# EasyEDA schematic RPi_Argon_WateringSystem.json
TITLE: Schematic RPi/Argon Watering System; REV: 1.0; Date: 2021-05-22; Sheet: 1/1; Drawn By: Tiffany Nolan; Company: Student
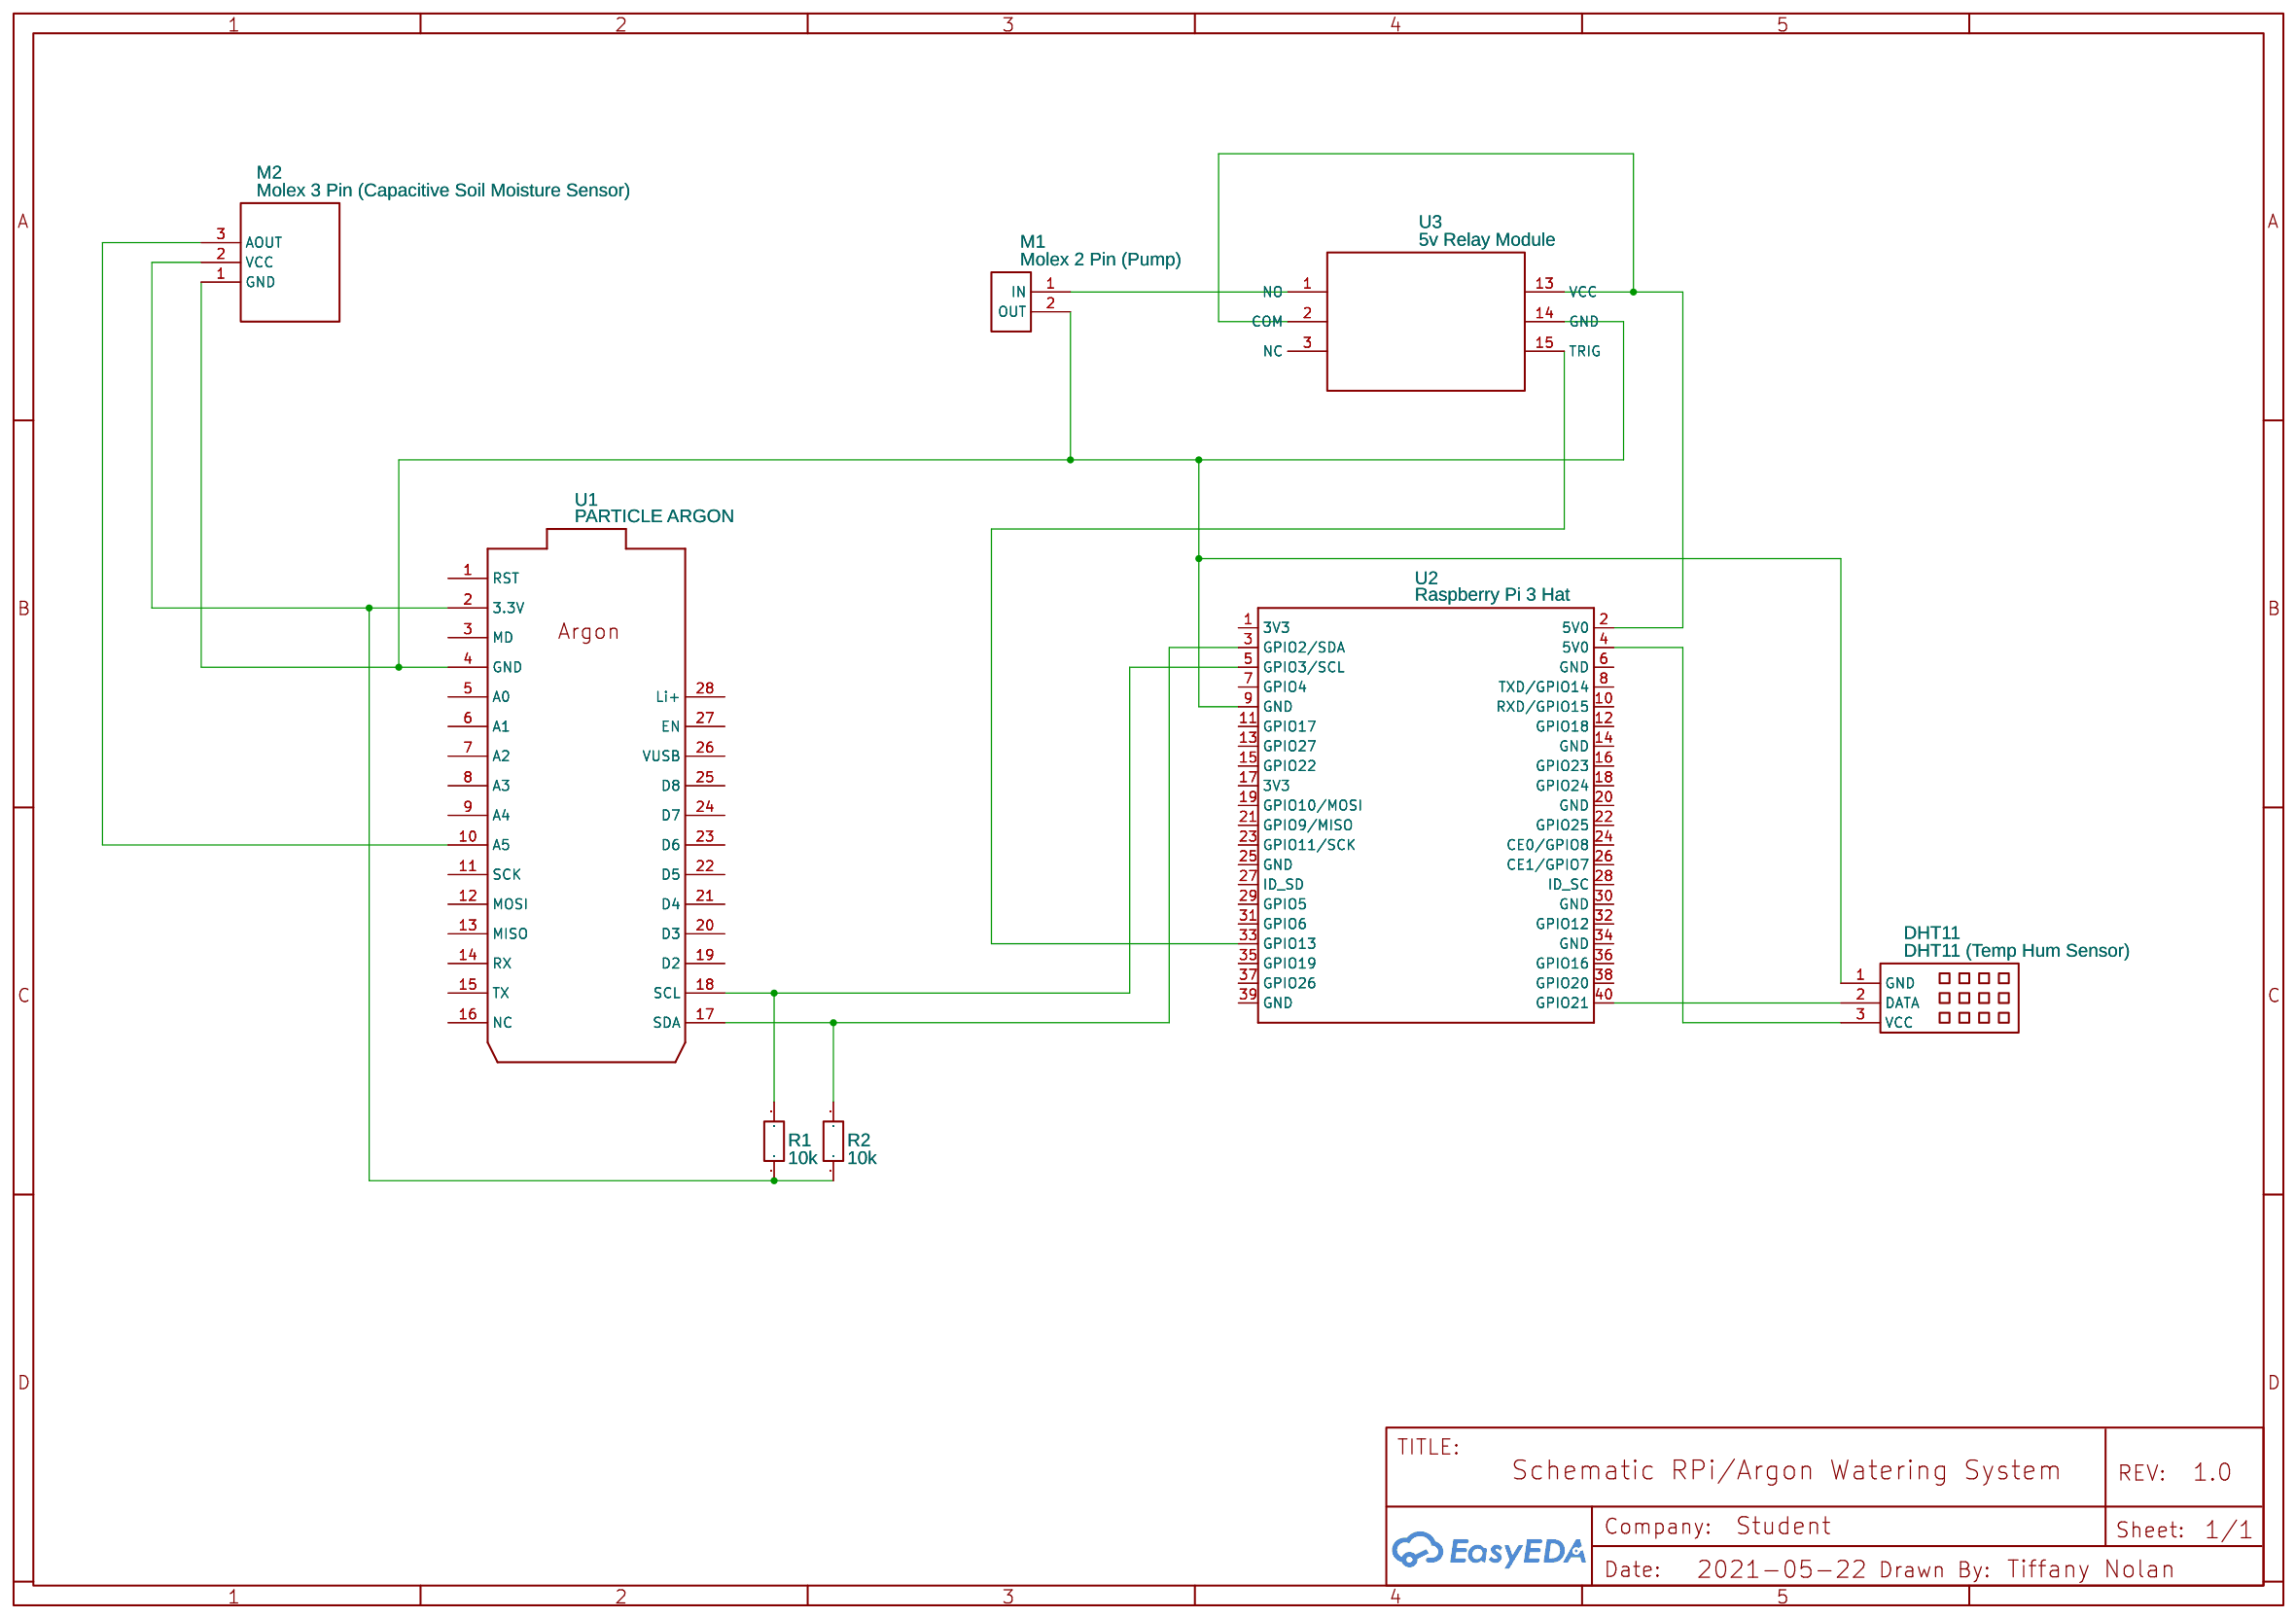
[diagram p0: schematic sheet]

## Parts
DHT11  DHT11 (Temp Hum Sensor)  [DHT11]
M1  Molex 2 Pin (Pump)  [MOLEX_5MM]
M2  Molex 3 Pin (Capacitive Soil Moisture Sensor)  [CAPACITIVE SOIL MOISTURE SENSOR V1.2]
R1  10k  [R0603]
R2  10k  [R0603]
U1  PARTICLE ARGON  [PARTICLE ARGON]
U2  Raspberry Pi 3 Hat  [HDR2X20-RASPBERRY_PI_GPIO_DIRECTION]
U3  5v Relay Module  [12V RELAY MODULE]

## Library data of the parts
DHT11 = DHT11: Supplier: LCSC; Manufacturer: MAXIM; Manufacturer Part: DS18B20+; image: //image.lceda.cn/szlcsc/C9753.jpg; Supplier Part: C9753; Contributor: Никиттосик Котяра
M1 = Molex 2 Pin: Contributor: joelillo
M2 = Capacitive Soil Moisture Sensor v1.2: Contributor: tonydc
R1 R2 = R_0603_EU: Contributor: LCEDA_Lib
U1 = PARTICLE ARGON: Manufacturer: Particle; Manufacturer Part: Particle Argon; Supplier Part: Particle Argon; Supplier: Particle; Contributor: stevecoster
U2 = Raspberry Pi 3 Hat: Manufacturer Part: RaspberryPi 3; Contributor: stefanczykdk; Supplier: RaspberryPi.org
U3 = 12v Relay Module: Contributor: leonard_2325

## Nets
Net-(DHT11-1): DHT11.1(GND) M1.2(OUT) M2.1(GND) U1.4(GND) U2.9(GND)
Net-(DHT11-2): DHT11.2(DATA) U2.40(GPIO21)
Net-(DHT11-3): DHT11.3(VCC) U2.4(5V0)
Net-(M2-2): M2.2(VCC) R1.1 R2.1 U1.2(3.3V)
Net-(M2-3): M2.3(AOUT) U1.10(A5)
Net-(R1-2): R1.2 U1.18(SCL) U2.5(GPIO3/SCL)
Net-(R2-2): R2.2 U1.17(SDA) U2.3(GPIO2/SDA)

Not connected (* = marked no-connect by the designer): M1 1(IN); U1 1(RST) 3(MD) 5(A0) 6(A1) 7(A2) 8(A3) 9(A4) 11(SCK) 12(MOSI) 13(MISO) 14(RX) 15(TX) 16(NC) 19(D2) 20(D3) 21(D4) 22(D5) 23(D6) 24(D7) 25(D8) 26(VUSB) 27(EN) 28(Li+); U2 1(3V3) 2(5V0) 6(GND) 7(GPIO4) 8(TXD/GPIO14) 10(RXD/GPIO15) 11(GPIO17) 12(GPIO18) 13(GPIO27) 14(GND) 15(GPIO22) 16(GPIO23) 17(3V3) 18(GPIO24) 19(GPIO10/MOSI) 20(GND) 21(GPIO9/MISO) 22(GPIO25) 23(GPIO11/SCK) 24(CE0/GPIO8) 25(GND) 26(CE1/GPIO7) 27(ID_SD) 28(ID_SC) 29(GPIO5) 30(GND) 31(GPIO6) 32(GPIO12) 33(GPIO13) 34(GND) 35(GPIO19) 36(GPIO16) 37(GPIO26) 38(GPIO20) 39(GND); U3 1(NO) 2(COM) 3(NC) 13(VCC) 14(GND) 15(TRIG)
